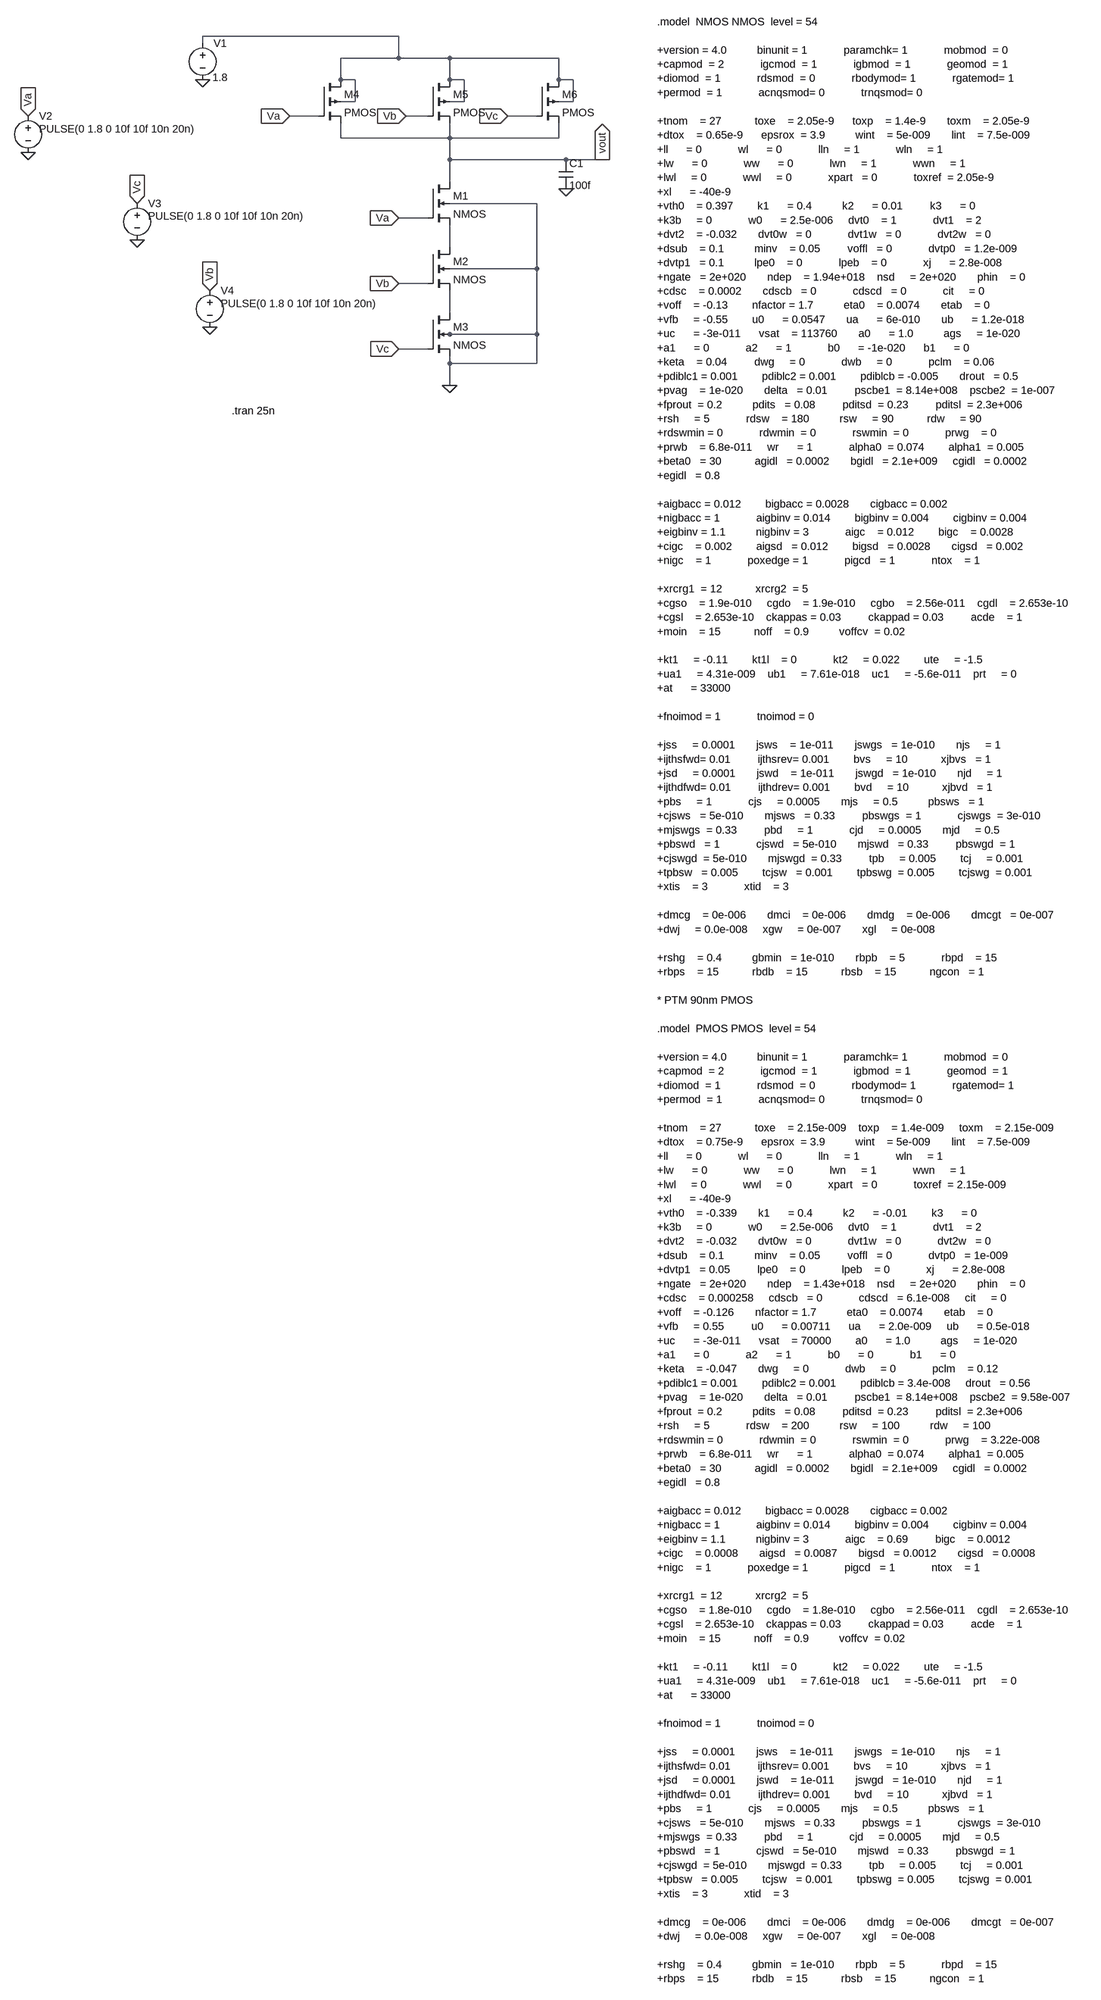
[diagram p0: schematic nandgate optimization low power design.asc]
nandgate optimization low power design.asc, the LTspice schematic file:
Version 4
SHEET 1 1840 3680
WIRE 64 -192 -368 -192
WIRE -368 -176 -368 -192
WIRE 64 -144 64 -192
WIRE 64 -144 -64 -144
WIRE 176 -144 64 -144
WIRE 416 -144 176 -144
WIRE -64 -96 -64 -144
WIRE -32 -96 -64 -96
WIRE 176 -96 176 -144
WIRE 208 -96 176 -96
WIRE 416 -96 416 -144
WIRE 448 -96 416 -96
WIRE -32 -48 -32 -96
WIRE -32 -48 -64 -48
WIRE 208 -48 208 -96
WIRE 208 -48 176 -48
WIRE 448 -48 448 -96
WIRE 448 -48 416 -48
WIRE -112 -16 -176 -16
WIRE 128 -16 80 -16
WIRE 368 -16 304 -16
WIRE -64 32 -64 0
WIRE 176 32 176 0
WIRE 176 32 -64 32
WIRE 416 32 416 0
WIRE 416 32 176 32
WIRE 176 80 176 32
WIRE 432 80 176 80
WIRE 512 80 432 80
WIRE 528 80 512 80
WIRE 176 128 176 80
WIRE 368 176 176 176
WIRE 128 208 64 208
WIRE 176 272 176 224
WIRE 368 320 368 176
WIRE 368 320 176 320
WIRE 128 352 64 352
WIRE 176 416 176 368
WIRE 176 464 160 464
WIRE 368 464 368 320
WIRE 368 464 176 464
WIRE 128 496 64 496
WIRE 176 528 176 512
WIRE 368 528 368 464
WIRE 368 528 176 528
WIRE 176 576 176 528
FLAG -368 -96 0
FLAG -752 64 0
FLAG -512 256 0
FLAG -352 448 0
FLAG 176 576 0
FLAG -176 -16 Va
IOPIN -176 -16 In
FLAG -752 -16 Va
IOPIN -752 -16 In
FLAG -512 176 Vc
IOPIN -512 176 In
FLAG 64 208 Va
IOPIN 64 208 In
FLAG 64 352 Vb
IOPIN 64 352 In
FLAG 64 496 Vc
IOPIN 64 496 In
FLAG -352 368 Vb
IOPIN -352 368 In
FLAG 80 -16 Vb
IOPIN 80 -16 In
FLAG 304 -16 Vc
IOPIN 304 -16 In
FLAG 512 80 vout
IOPIN 512 80 Out
FLAG 432 144 0
SYMBOL nmos4 128 128 R0
SYMATTR InstName M1
SYMATTR Value2 l=180n w=360n
SYMBOL nmos4 128 272 R0
SYMATTR InstName M2
SYMATTR Value2 l=180n w=540n
SYMBOL nmos4 128 416 R0
SYMATTR InstName M3
SYMATTR Value2 l=180n w=900n
SYMBOL pmos4 -112 -96 R0
SYMATTR InstName M4
SYMATTR Value2 l=180n w=1440n
SYMBOL pmos4 128 -96 R0
SYMATTR InstName M5
SYMATTR Value2 l=180n w=1440n
SYMBOL pmos4 368 -96 R0
SYMATTR InstName M6
SYMATTR Value2 l=180n w=1440n
SYMBOL voltage -368 -192 R0
WINDOW 3 22 91 Left 2
WINDOW 123 0 0 Left 0
WINDOW 39 0 0 Left 0
SYMATTR Value 1.8
SYMATTR InstName V1
SYMBOL voltage -752 -32 R0
WINDOW 3 24 44 Left 2
WINDOW 123 0 0 Left 0
WINDOW 39 0 0 Left 0
SYMATTR Value PULSE(0 1.8 0 10f 10f 10n 20n)
SYMATTR InstName V2
SYMBOL voltage -512 160 R0
WINDOW 3 24 44 Left 2
WINDOW 123 0 0 Left 0
WINDOW 39 0 0 Left 0
SYMATTR Value PULSE(0 1.8 0 10f 10f 10n 20n)
SYMATTR InstName V3
SYMBOL voltage -352 352 R0
WINDOW 3 24 44 Left 2
WINDOW 123 0 0 Left 0
WINDOW 39 0 0 Left 0
SYMATTR Value PULSE(0 1.8 0 10f 10f 10n 20n)
SYMATTR InstName V4
SYMBOL cap 416 80 R0
SYMATTR InstName C1
SYMATTR Value 100f
TEXT 816 -224 Left 2 !.model  NMOS NMOS  level = 54\n \n+version = 4.0          binunit = 1            paramchk= 1            mobmod  = 0          \n+capmod  = 2            igcmod  = 1            igbmod  = 1            geomod  = 1          \n+diomod  = 1            rdsmod  = 0            rbodymod= 1            rgatemod= 1          \n+permod  = 1            acnqsmod= 0            trnqsmod= 0          \n \n+tnom    = 27           toxe    = 2.05e-9      toxp    = 1.4e-9       toxm    = 2.05e-9   \n+dtox    = 0.65e-9      epsrox  = 3.9          wint    = 5e-009       lint    = 7.5e-009   \n+ll      = 0            wl      = 0            lln     = 1            wln     = 1          \n+lw      = 0            ww      = 0            lwn     = 1            wwn     = 1          \n+lwl     = 0            wwl     = 0            xpart   = 0            toxref  = 2.05e-9   \n+xl      = -40e-9\n+vth0    = 0.397        k1      = 0.4          k2      = 0.01         k3      = 0          \n+k3b     = 0            w0      = 2.5e-006     dvt0    = 1            dvt1    = 2       \n+dvt2    = -0.032       dvt0w   = 0            dvt1w   = 0            dvt2w   = 0          \n+dsub    = 0.1          minv    = 0.05         voffl   = 0            dvtp0   = 1.2e-009     \n+dvtp1   = 0.1          lpe0    = 0            lpeb    = 0            xj      = 2.8e-008   \n+ngate   = 2e+020       ndep    = 1.94e+018    nsd     = 2e+020       phin    = 0          \n+cdsc    = 0.0002       cdscb   = 0            cdscd   = 0            cit     = 0          \n+voff    = -0.13        nfactor = 1.7          eta0    = 0.0074       etab    = 0          \n+vfb     = -0.55        u0      = 0.0547       ua      = 6e-010       ub      = 1.2e-018     \n+uc      = -3e-011      vsat    = 113760       a0      = 1.0          ags     = 1e-020     \n+a1      = 0            a2      = 1            b0      = -1e-020      b1      = 0          \n+keta    = 0.04         dwg     = 0            dwb     = 0            pclm    = 0.06       \n+pdiblc1 = 0.001        pdiblc2 = 0.001        pdiblcb = -0.005       drout   = 0.5        \n+pvag    = 1e-020       delta   = 0.01         pscbe1  = 8.14e+008    pscbe2  = 1e-007     \n+fprout  = 0.2          pdits   = 0.08         pditsd  = 0.23         pditsl  = 2.3e+006   \n+rsh     = 5            rdsw    = 180          rsw     = 90           rdw     = 90        \n+rdswmin = 0            rdwmin  = 0            rswmin  = 0            prwg    = 0          \n+prwb    = 6.8e-011     wr      = 1            alpha0  = 0.074        alpha1  = 0.005      \n+beta0   = 30           agidl   = 0.0002       bgidl   = 2.1e+009     cgidl   = 0.0002     \n+egidl   = 0.8          \n \n+aigbacc = 0.012        bigbacc = 0.0028       cigbacc = 0.002     \n+nigbacc = 1            aigbinv = 0.014        bigbinv = 0.004        cigbinv = 0.004      \n+eigbinv = 1.1          nigbinv = 3            aigc    = 0.012        bigc    = 0.0028     \n+cigc    = 0.002        aigsd   = 0.012        bigsd   = 0.0028       cigsd   = 0.002     \n+nigc    = 1            poxedge = 1            pigcd   = 1            ntox    = 1          \n \n+xrcrg1  = 12           xrcrg2  = 5          \n+cgso    = 1.9e-010     cgdo    = 1.9e-010     cgbo    = 2.56e-011    cgdl    = 2.653e-10     \n+cgsl    = 2.653e-10    ckappas = 0.03         ckappad = 0.03         acde    = 1          \n+moin    = 15           noff    = 0.9          voffcv  = 0.02       \n \n+kt1     = -0.11        kt1l    = 0            kt2     = 0.022        ute     = -1.5       \n+ua1     = 4.31e-009    ub1     = 7.61e-018    uc1     = -5.6e-011    prt     = 0          \n+at      = 33000      \n \n+fnoimod = 1            tnoimod = 0          \n \n+jss     = 0.0001       jsws    = 1e-011       jswgs   = 1e-010       njs     = 1          \n+ijthsfwd= 0.01         ijthsrev= 0.001        bvs     = 10           xjbvs   = 1          \n+jsd     = 0.0001       jswd    = 1e-011       jswgd   = 1e-010       njd     = 1          \n+ijthdfwd= 0.01         ijthdrev= 0.001        bvd     = 10           xjbvd   = 1          \n+pbs     = 1            cjs     = 0.0005       mjs     = 0.5          pbsws   = 1          \n+cjsws   = 5e-010       mjsws   = 0.33         pbswgs  = 1            cjswgs  = 3e-010     \n+mjswgs  = 0.33         pbd     = 1            cjd     = 0.0005       mjd     = 0.5        \n+pbswd   = 1            cjswd   = 5e-010       mjswd   = 0.33         pbswgd  = 1          \n+cjswgd  = 5e-010       mjswgd  = 0.33         tpb     = 0.005        tcj     = 0.001      \n+tpbsw   = 0.005        tcjsw   = 0.001        tpbswg  = 0.005        tcjswg  = 0.001      \n+xtis    = 3            xtid    = 3          \n \n+dmcg    = 0e-006       dmci    = 0e-006       dmdg    = 0e-006       dmcgt   = 0e-007     \n+dwj     = 0.0e-008     xgw     = 0e-007       xgl     = 0e-008     \n \n+rshg    = 0.4          gbmin   = 1e-010       rbpb    = 5            rbpd    = 15         \n+rbps    = 15           rbdb    = 15           rbsb    = 15           ngcon   = 1          \n \n* PTM 90nm PMOS\n \n.model  PMOS PMOS  level = 54\n \n+version = 4.0          binunit = 1            paramchk= 1            mobmod  = 0          \n+capmod  = 2            igcmod  = 1            igbmod  = 1            geomod  = 1          \n+diomod  = 1            rdsmod  = 0            rbodymod= 1            rgatemod= 1          \n+permod  = 1            acnqsmod= 0            trnqsmod= 0          \n \n+tnom    = 27           toxe    = 2.15e-009    toxp    = 1.4e-009     toxm    = 2.15e-009   \n+dtox    = 0.75e-9      epsrox  = 3.9          wint    = 5e-009       lint    = 7.5e-009   \n+ll      = 0            wl      = 0            lln     = 1            wln     = 1          \n+lw      = 0            ww      = 0            lwn     = 1            wwn     = 1          \n+lwl     = 0            wwl     = 0            xpart   = 0            toxref  = 2.15e-009   \n+xl      = -40e-9\n+vth0    = -0.339       k1      = 0.4          k2      = -0.01        k3      = 0          \n+k3b     = 0            w0      = 2.5e-006     dvt0    = 1            dvt1    = 2       \n+dvt2    = -0.032       dvt0w   = 0            dvt1w   = 0            dvt2w   = 0          \n+dsub    = 0.1          minv    = 0.05         voffl   = 0            dvtp0   = 1e-009     \n+dvtp1   = 0.05         lpe0    = 0            lpeb    = 0            xj      = 2.8e-008   \n+ngate   = 2e+020       ndep    = 1.43e+018    nsd     = 2e+020       phin    = 0          \n+cdsc    = 0.000258     cdscb   = 0            cdscd   = 6.1e-008     cit     = 0          \n+voff    = -0.126       nfactor = 1.7          eta0    = 0.0074       etab    = 0          \n+vfb     = 0.55         u0      = 0.00711      ua      = 2.0e-009     ub      = 0.5e-018     \n+uc      = -3e-011      vsat    = 70000        a0      = 1.0          ags     = 1e-020     \n+a1      = 0            a2      = 1            b0      = 0            b1      = 0          \n+keta    = -0.047       dwg     = 0            dwb     = 0            pclm    = 0.12       \n+pdiblc1 = 0.001        pdiblc2 = 0.001        pdiblcb = 3.4e-008     drout   = 0.56       \n+pvag    = 1e-020       delta   = 0.01         pscbe1  = 8.14e+008    pscbe2  = 9.58e-007  \n+fprout  = 0.2          pdits   = 0.08         pditsd  = 0.23         pditsl  = 2.3e+006   \n+rsh     = 5            rdsw    = 200          rsw     = 100          rdw     = 100        \n+rdswmin = 0            rdwmin  = 0            rswmin  = 0            prwg    = 3.22e-008  \n+prwb    = 6.8e-011     wr      = 1            alpha0  = 0.074        alpha1  = 0.005      \n+beta0   = 30           agidl   = 0.0002       bgidl   = 2.1e+009     cgidl   = 0.0002     \n+egidl   = 0.8          \n \n+aigbacc = 0.012        bigbacc = 0.0028       cigbacc = 0.002     \n+nigbacc = 1            aigbinv = 0.014        bigbinv = 0.004        cigbinv = 0.004      \n+eigbinv = 1.1          nigbinv = 3            aigc    = 0.69         bigc    = 0.0012     \n+cigc    = 0.0008       aigsd   = 0.0087       bigsd   = 0.0012       cigsd   = 0.0008     \n+nigc    = 1            poxedge = 1            pigcd   = 1            ntox    = 1 \n         \n+xrcrg1  = 12           xrcrg2  = 5          \n+cgso    = 1.8e-010     cgdo    = 1.8e-010     cgbo    = 2.56e-011    cgdl    = 2.653e-10\n+cgsl    = 2.653e-10    ckappas = 0.03         ckappad = 0.03         acde    = 1\n+moin    = 15           noff    = 0.9          voffcv  = 0.02\n \n+kt1     = -0.11        kt1l    = 0            kt2     = 0.022        ute     = -1.5       \n+ua1     = 4.31e-009    ub1     = 7.61e-018    uc1     = -5.6e-011    prt     = 0          \n+at      = 33000      \n \n+fnoimod = 1            tnoimod = 0          \n \n+jss     = 0.0001       jsws    = 1e-011       jswgs   = 1e-010       njs     = 1          \n+ijthsfwd= 0.01         ijthsrev= 0.001        bvs     = 10           xjbvs   = 1          \n+jsd     = 0.0001       jswd    = 1e-011       jswgd   = 1e-010       njd     = 1          \n+ijthdfwd= 0.01         ijthdrev= 0.001        bvd     = 10           xjbvd   = 1          \n+pbs     = 1            cjs     = 0.0005       mjs     = 0.5          pbsws   = 1          \n+cjsws   = 5e-010       mjsws   = 0.33         pbswgs  = 1            cjswgs  = 3e-010     \n+mjswgs  = 0.33         pbd     = 1            cjd     = 0.0005       mjd     = 0.5        \n+pbswd   = 1            cjswd   = 5e-010       mjswd   = 0.33         pbswgd  = 1          \n+cjswgd  = 5e-010       mjswgd  = 0.33         tpb     = 0.005        tcj     = 0.001      \n+tpbsw   = 0.005        tcjsw   = 0.001        tpbswg  = 0.005        tcjswg  = 0.001      \n+xtis    = 3            xtid    = 3          \n \n+dmcg    = 0e-006       dmci    = 0e-006       dmdg    = 0e-006       dmcgt   = 0e-007     \n+dwj     = 0.0e-008     xgw     = 0e-007       xgl     = 0e-008     \n \n+rshg    = 0.4          gbmin   = 1e-010       rbpb    = 5            rbpd    = 15         \n+rbps    = 15           rbdb    = 15           rbsb    = 15           ngcon   = 1
TEXT -304 632 Left 2 !.tran 25n

The netlist it stands for:
* nandgate optimization low power design.asc
M1 vout Va N002 0 NMOS l=180n w=360n
M2 N002 Vb N003 0 NMOS l=180n w=540n
M3 N003 Vc 0 0 NMOS l=180n w=900n
M4 N001 Va vout N001 PMOS l=180n w=1440n
M5 N001 Vb vout N001 PMOS l=180n w=1440n
M6 N001 Vc vout N001 PMOS l=180n w=1440n
V1 N001 0 1.8
V2 Va 0 PULSE(0 1.8 0 10f 10f 10n 20n)
V3 Vc 0 PULSE(0 1.8 0 10f 10f 10n 20n)
V4 Vb 0 PULSE(0 1.8 0 10f 10f 10n 20n)
C1 vout 0 100f
.model NMOS NMOS
.model PMOS PMOS
.lib standard.mos
.model  NMOS NMOS  level = 54
+version = 4.0          binunit = 1            paramchk= 1            mobmod  = 0
+capmod  = 2            igcmod  = 1            igbmod  = 1            geomod  = 1
+diomod  = 1            rdsmod  = 0            rbodymod= 1            rgatemod= 1
+permod  = 1            acnqsmod= 0            trnqsmod= 0
+tnom    = 27           toxe    = 2.05e-9      toxp    = 1.4e-9       toxm    = 2.05e-9
+dtox    = 0.65e-9      epsrox  = 3.9          wint    = 5e-009       lint    = 7.5e-009
+ll      = 0            wl      = 0            lln     = 1            wln     = 1
+lw      = 0            ww      = 0            lwn     = 1            wwn     = 1
+lwl     = 0            wwl     = 0            xpart   = 0            toxref  = 2.05e-9
+xl      = -40e-9
+vth0    = 0.397        k1      = 0.4          k2      = 0.01         k3      = 0
+k3b     = 0            w0      = 2.5e-006     dvt0    = 1            dvt1    = 2
+dvt2    = -0.032       dvt0w   = 0            dvt1w   = 0            dvt2w   = 0
+dsub    = 0.1          minv    = 0.05         voffl   = 0            dvtp0   = 1.2e-009
+dvtp1   = 0.1          lpe0    = 0            lpeb    = 0            xj      = 2.8e-008
+ngate   = 2e+020       ndep    = 1.94e+018    nsd     = 2e+020       phin    = 0
+cdsc    = 0.0002       cdscb   = 0            cdscd   = 0            cit     = 0
+voff    = -0.13        nfactor = 1.7          eta0    = 0.0074       etab    = 0
+vfb     = -0.55        u0      = 0.0547       ua      = 6e-010       ub      = 1.2e-018
+uc      = -3e-011      vsat    = 113760       a0      = 1.0          ags     = 1e-020
+a1      = 0            a2      = 1            b0      = -1e-020      b1      = 0
+keta    = 0.04         dwg     = 0            dwb     = 0            pclm    = 0.06
+pdiblc1 = 0.001        pdiblc2 = 0.001        pdiblcb = -0.005       drout   = 0.5
+pvag    = 1e-020       delta   = 0.01         pscbe1  = 8.14e+008    pscbe2  = 1e-007
+fprout  = 0.2          pdits   = 0.08         pditsd  = 0.23         pditsl  = 2.3e+006
+rsh     = 5            rdsw    = 180          rsw     = 90           rdw     = 90
+rdswmin = 0            rdwmin  = 0            rswmin  = 0            prwg    = 0
+prwb    = 6.8e-011     wr      = 1            alpha0  = 0.074        alpha1  = 0.005
+beta0   = 30           agidl   = 0.0002       bgidl   = 2.1e+009     cgidl   = 0.0002
+egidl   = 0.8
+aigbacc = 0.012        bigbacc = 0.0028       cigbacc = 0.002
+nigbacc = 1            aigbinv = 0.014        bigbinv = 0.004        cigbinv = 0.004
+eigbinv = 1.1          nigbinv = 3            aigc    = 0.012        bigc    = 0.0028
+cigc    = 0.002        aigsd   = 0.012        bigsd   = 0.0028       cigsd   = 0.002
+nigc    = 1            poxedge = 1            pigcd   = 1            ntox    = 1
+xrcrg1  = 12           xrcrg2  = 5
+cgso    = 1.9e-010     cgdo    = 1.9e-010     cgbo    = 2.56e-011    cgdl    = 2.653e-10
+cgsl    = 2.653e-10    ckappas = 0.03         ckappad = 0.03         acde    = 1
+moin    = 15           noff    = 0.9          voffcv  = 0.02
+kt1     = -0.11        kt1l    = 0            kt2     = 0.022        ute     = -1.5
+ua1     = 4.31e-009    ub1     = 7.61e-018    uc1     = -5.6e-011    prt     = 0
+at      = 33000
+fnoimod = 1            tnoimod = 0
+jss     = 0.0001       jsws    = 1e-011       jswgs   = 1e-010       njs     = 1
+ijthsfwd= 0.01         ijthsrev= 0.001        bvs     = 10           xjbvs   = 1
+jsd     = 0.0001       jswd    = 1e-011       jswgd   = 1e-010       njd     = 1
+ijthdfwd= 0.01         ijthdrev= 0.001        bvd     = 10           xjbvd   = 1
+pbs     = 1            cjs     = 0.0005       mjs     = 0.5          pbsws   = 1
+cjsws   = 5e-010       mjsws   = 0.33         pbswgs  = 1            cjswgs  = 3e-010
+mjswgs  = 0.33         pbd     = 1            cjd     = 0.0005       mjd     = 0.5
+pbswd   = 1            cjswd   = 5e-010       mjswd   = 0.33         pbswgd  = 1
+cjswgd  = 5e-010       mjswgd  = 0.33         tpb     = 0.005        tcj     = 0.001
+tpbsw   = 0.005        tcjsw   = 0.001        tpbswg  = 0.005        tcjswg  = 0.001
+xtis    = 3            xtid    = 3
+dmcg    = 0e-006       dmci    = 0e-006       dmdg    = 0e-006       dmcgt   = 0e-007
+dwj     = 0.0e-008     xgw     = 0e-007       xgl     = 0e-008
+rshg    = 0.4          gbmin   = 1e-010       rbpb    = 5            rbpd    = 15
+rbps    = 15           rbdb    = 15           rbsb    = 15           ngcon   = 1
* PTM 90nm PMOS
.model  PMOS PMOS  level = 54
+version = 4.0          binunit = 1            paramchk= 1            mobmod  = 0
+capmod  = 2            igcmod  = 1            igbmod  = 1            geomod  = 1
+diomod  = 1            rdsmod  = 0            rbodymod= 1            rgatemod= 1
+permod  = 1            acnqsmod= 0            trnqsmod= 0
+tnom    = 27           toxe    = 2.15e-009    toxp    = 1.4e-009     toxm    = 2.15e-009
+dtox    = 0.75e-9      epsrox  = 3.9          wint    = 5e-009       lint    = 7.5e-009
+ll      = 0            wl      = 0            lln     = 1            wln     = 1
+lw      = 0            ww      = 0            lwn     = 1            wwn     = 1
+lwl     = 0            wwl     = 0            xpart   = 0            toxref  = 2.15e-009
+xl      = -40e-9
+vth0    = -0.339       k1      = 0.4          k2      = -0.01        k3      = 0
+k3b     = 0            w0      = 2.5e-006     dvt0    = 1            dvt1    = 2
+dvt2    = -0.032       dvt0w   = 0            dvt1w   = 0            dvt2w   = 0
+dsub    = 0.1          minv    = 0.05         voffl   = 0            dvtp0   = 1e-009
+dvtp1   = 0.05         lpe0    = 0            lpeb    = 0            xj      = 2.8e-008
+ngate   = 2e+020       ndep    = 1.43e+018    nsd     = 2e+020       phin    = 0
+cdsc    = 0.000258     cdscb   = 0            cdscd   = 6.1e-008     cit     = 0
+voff    = -0.126       nfactor = 1.7          eta0    = 0.0074       etab    = 0
+vfb     = 0.55         u0      = 0.00711      ua      = 2.0e-009     ub      = 0.5e-018
+uc      = -3e-011      vsat    = 70000        a0      = 1.0          ags     = 1e-020
+a1      = 0            a2      = 1            b0      = 0            b1      = 0
+keta    = -0.047       dwg     = 0            dwb     = 0            pclm    = 0.12
+pdiblc1 = 0.001        pdiblc2 = 0.001        pdiblcb = 3.4e-008     drout   = 0.56
+pvag    = 1e-020       delta   = 0.01         pscbe1  = 8.14e+008    pscbe2  = 9.58e-007
+fprout  = 0.2          pdits   = 0.08         pditsd  = 0.23         pditsl  = 2.3e+006
+rsh     = 5            rdsw    = 200          rsw     = 100          rdw     = 100
+rdswmin = 0            rdwmin  = 0            rswmin  = 0            prwg    = 3.22e-008
+prwb    = 6.8e-011     wr      = 1            alpha0  = 0.074        alpha1  = 0.005
+beta0   = 30           agidl   = 0.0002       bgidl   = 2.1e+009     cgidl   = 0.0002
+egidl   = 0.8
+aigbacc = 0.012        bigbacc = 0.0028       cigbacc = 0.002
+nigbacc = 1            aigbinv = 0.014        bigbinv = 0.004        cigbinv = 0.004
+eigbinv = 1.1          nigbinv = 3            aigc    = 0.69         bigc    = 0.0012
+cigc    = 0.0008       aigsd   = 0.0087       bigsd   = 0.0012       cigsd   = 0.0008
+nigc    = 1            poxedge = 1            pigcd   = 1            ntox    = 1
+xrcrg1  = 12           xrcrg2  = 5
+cgso    = 1.8e-010     cgdo    = 1.8e-010     cgbo    = 2.56e-011    cgdl    = 2.653e-10
+cgsl    = 2.653e-10    ckappas = 0.03         ckappad = 0.03         acde    = 1
+moin    = 15           noff    = 0.9          voffcv  = 0.02
+kt1     = -0.11        kt1l    = 0            kt2     = 0.022        ute     = -1.5
+ua1     = 4.31e-009    ub1     = 7.61e-018    uc1     = -5.6e-011    prt     = 0
+at      = 33000
+fnoimod = 1            tnoimod = 0
+jss     = 0.0001       jsws    = 1e-011       jswgs   = 1e-010       njs     = 1
+ijthsfwd= 0.01         ijthsrev= 0.001        bvs     = 10           xjbvs   = 1
+jsd     = 0.0001       jswd    = 1e-011       jswgd   = 1e-010       njd     = 1
+ijthdfwd= 0.01         ijthdrev= 0.001        bvd     = 10           xjbvd   = 1
+pbs     = 1            cjs     = 0.0005       mjs     = 0.5          pbsws   = 1
+cjsws   = 5e-010       mjsws   = 0.33         pbswgs  = 1            cjswgs  = 3e-010
+mjswgs  = 0.33         pbd     = 1            cjd     = 0.0005       mjd     = 0.5
+pbswd   = 1            cjswd   = 5e-010       mjswd   = 0.33         pbswgd  = 1
+cjswgd  = 5e-010       mjswgd  = 0.33         tpb     = 0.005        tcj     = 0.001
+tpbsw   = 0.005        tcjsw   = 0.001        tpbswg  = 0.005        tcjswg  = 0.001
+xtis    = 3            xtid    = 3
+dmcg    = 0e-006       dmci    = 0e-006       dmdg    = 0e-006       dmcgt   = 0e-007
+dwj     = 0.0e-008     xgw     = 0e-007       xgl     = 0e-008
+rshg    = 0.4          gbmin   = 1e-010       rbpb    = 5            rbpd    = 15
+rbps    = 15           rbdb    = 15           rbsb    = 15           ngcon   = 1
.tran 25n
.backanno
.end